# Altium schematic sheet BOARD_CONNECTOR.SchDoc
size B
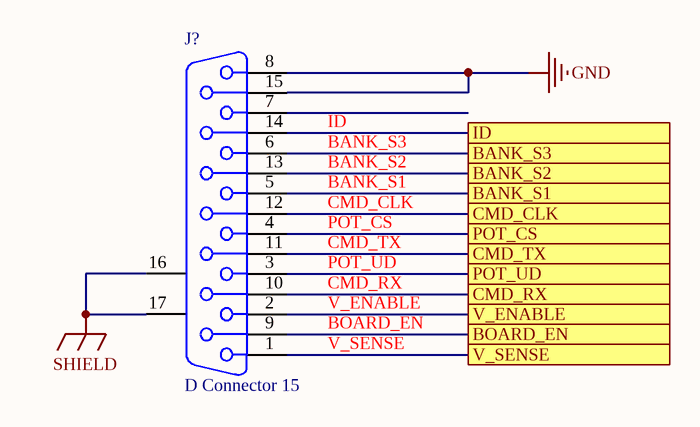
[diagram p0: BOARD_CONNECTOR.SchDoc]

## Parts
J?  D Connector 15  [DSUB1.385-2H15]

## Ports
BANK_S1, BANK_S2, BANK_S3, BOARD_EN, CMD_CLK, CMD_RX, CMD_TX, ID, POT_CS, POT_UD, V_ENABLE, V_SENSE

## Nets
GND: J?.8 J?.15
SHIELD: J?.16(MH1) J?.17(MH2)
BANK_S1: J?.5 ; port BANK_S1
BANK_S2: J?.13 ; port BANK_S2
BANK_S3: J?.6 ; port BANK_S3
BOARD_EN: J?.9 ; port BOARD_EN
CMD_CLK: J?.12 ; port CMD_CLK
CMD_RX: J?.10 ; port CMD_RX
CMD_TX: J?.11 ; port CMD_TX
ID: J?.14 ; port ID
POT_CS: J?.4 ; port POT_CS
POT_UD: J?.3 ; port POT_UD
V_ENABLE: J?.2 ; port V_ENABLE
V_SENSE: J?.1 ; port V_SENSE

Not connected (* = marked no-connect by the designer): J? 7

## Library data of the parts
J? = D Connector 15: Receptacle Assembly, 15 Position, Right Angle; PackageDocument: O; Positions: 15; Published: 15-Jun-2001; LatestRevisionDate: 17-Jul-2002; LatestRevisionNote: Re-released for DXP Platform.; DatasheetDocument: 1-Sep-99; PackageReference: 788757; Publisher: Altium Limited; Orientation: Right Angle; Gender: Receptacle